# EAGLE schematic mbed sonar (EAGLE 9.6.2)
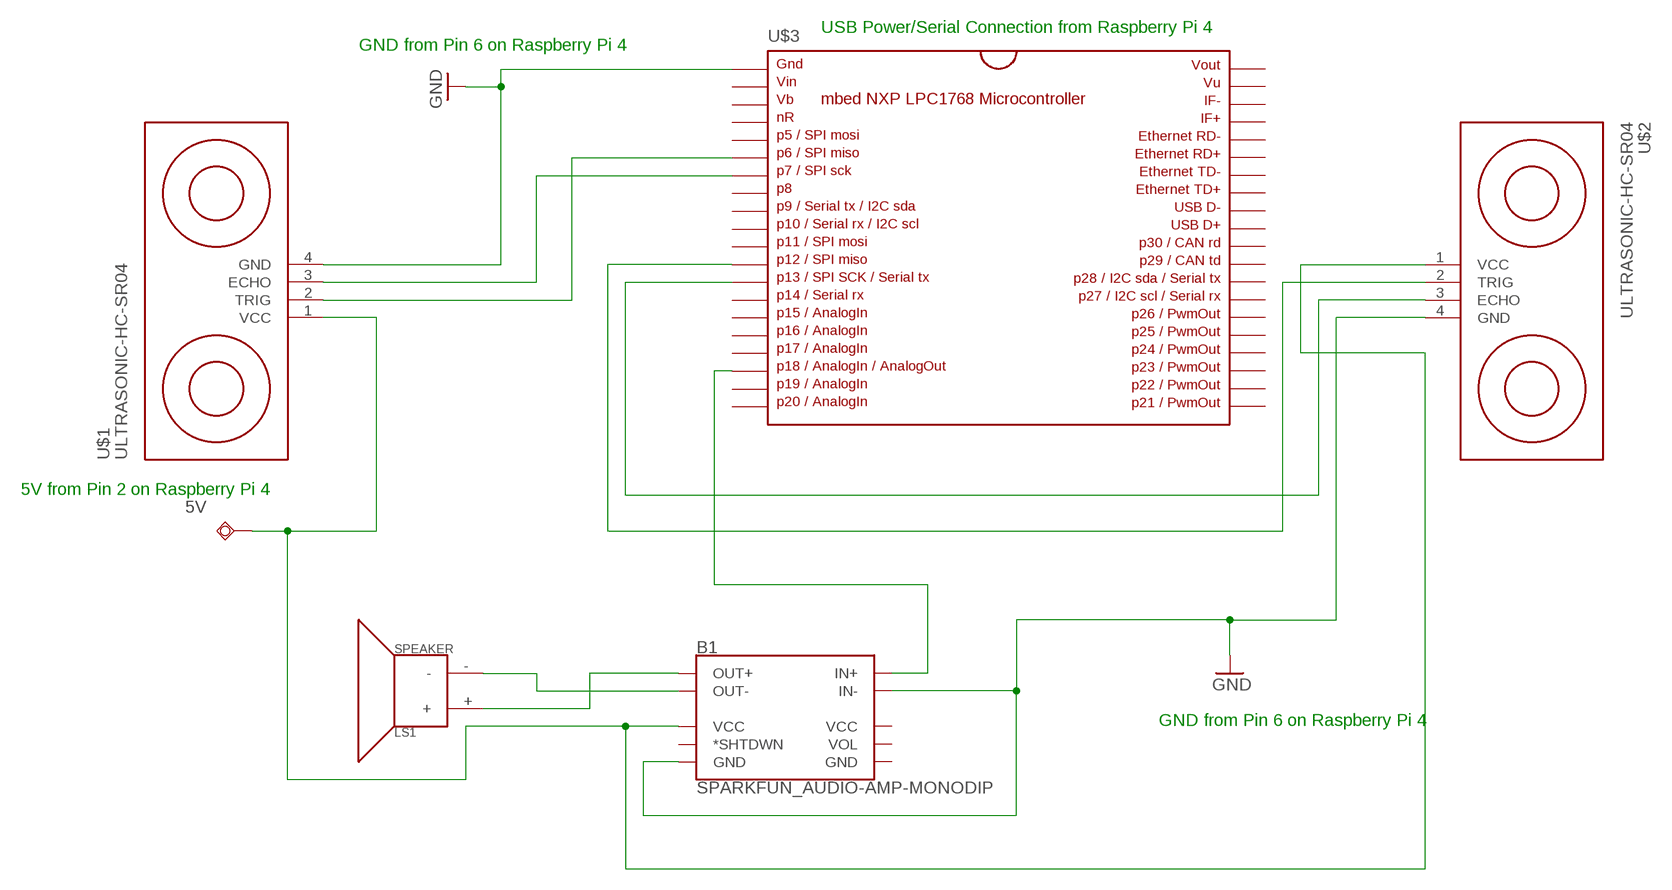
[diagram p0: schematic, sheet 1]

## Parts
5V  TPSQPAD1-20  [P1-20]
B1  SPARKFUN_AUDIO-AMP-MONODIP  [AUDIO-AMP-MONO]
LS1  SPEAKER  [PCB_MOUNT_SPEAKER]
U$1  ULTRASONIC-HC-SR04  [ULTRASONIC-HC-SR04]
U$2  ULTRASONIC-HC-SR04  [ULTRASONIC-HC-SR04]
U$3  MBED1768  MBED_NXP_LPC1768  [DIL40_0.9]

## Nets
GND: B1.IN- B1.PWR-(GND) U$1.4(GND) U$2.4(GND) U$3.1
N$1: B1.IN+ U$3.18
N$2: B1.OUT+ LS1.+
N$3: B1.OUT- LS1.-
N$4: 5V.TP B1.PWR+(VCC) U$1.1(VCC) U$2.1(VCC)
N$5: U$1.2(TRIG) U$3.6
N$6: U$1.3(ECHO) U$3.7
N$7: U$2.2(TRIG) U$3.12
N$8: U$2.3(ECHO) U$3.13
Unconnected: B1.S(*SHTDWN) B1.VOL B1.VOL+(VCC) B1.VOL-(GND) U$3.2 U$3.3 U$3.4 U$3.5 U$3.8 U$3.9 U$3.10 U$3.11 U$3.14 U$3.15 U$3.16 U$3.17 U$3.19 U$3.20 U$3.21 U$3.22 U$3.23 U$3.24 U$3.25 U$3.26 U$3.27 U$3.28 U$3.29 U$3.30 U$3.31 U$3.32 U$3.33 U$3.34 U$3.35 U$3.36 U$3.37 U$3.38 U$3.39 U$3.40

## Notes on the sheet
- USB Power/Serial Connection from Raspberry Pi 4
- GND from Pin 6 on Raspberry Pi 4
- 5V from Pin 2 on Raspberry Pi 4
- GND from Pin 6 on Raspberry Pi 4

## Library data of the parts
5V = testpad:TPSQ: Test pad
B1 = SparkFun-Boards:SPARKFUN_AUDIO-AMP-MONO: SparkFun Mono Audio Amp Breakout- TPA2005D1 This tiny audio amplifier is based on the Texas Instruments TPA2005D1. Its efficient class-D operation means low heat and long battery life. It can drive an 8-Ohm speaker at up to 1.4 Watts SparkFun Products: Mono Audio Amp Breakout <https://www.sparkfun.com/products/11044>
LS1 = SparkFun-Electromechanical:SPEAKER: Speaker Generic 2-terminal loudspeakers SparkFun Products Speaker - PCB Mount <https://www.sparkfun.com/products/11089> (COM-11089); PROD_ID: COMP-11789; SF_SKU: COM-11089
U$1 U$2 = diy-modules:ULTRASONIC-HC-SR04: Ultrasonic Ranging Module HC-SR04 More details available here: http://randomnerdtutorials.com/complete-guide-for-ultrasonic-sensor-hc-sr04/ Click here to find device on ebay.com <http://www.ebay.com/sch/hc+sr04+ultrasonic>
U$3 = SparkFun-Boards:MBED_NXP_LPC1768: mbed LPC1768 board footprint Boards using this footprint: mbed - LPC1768 (Cortex-M3) (DEV-09564); PROD_ID: COMP-12167